# Altium schematic sheet [01] Summary.SchDoc
size A4
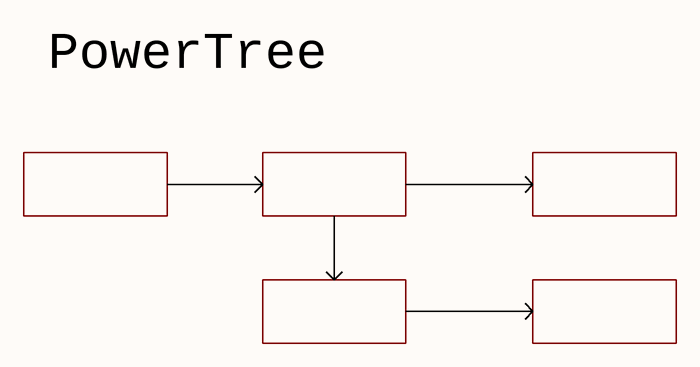
[diagram p0: [01] Summary.SchDoc]

## Notes on the sheet
- PowerTree